# EAGLE design Shield (EAGLE 8.3.1)

## Sheet 1 of 3
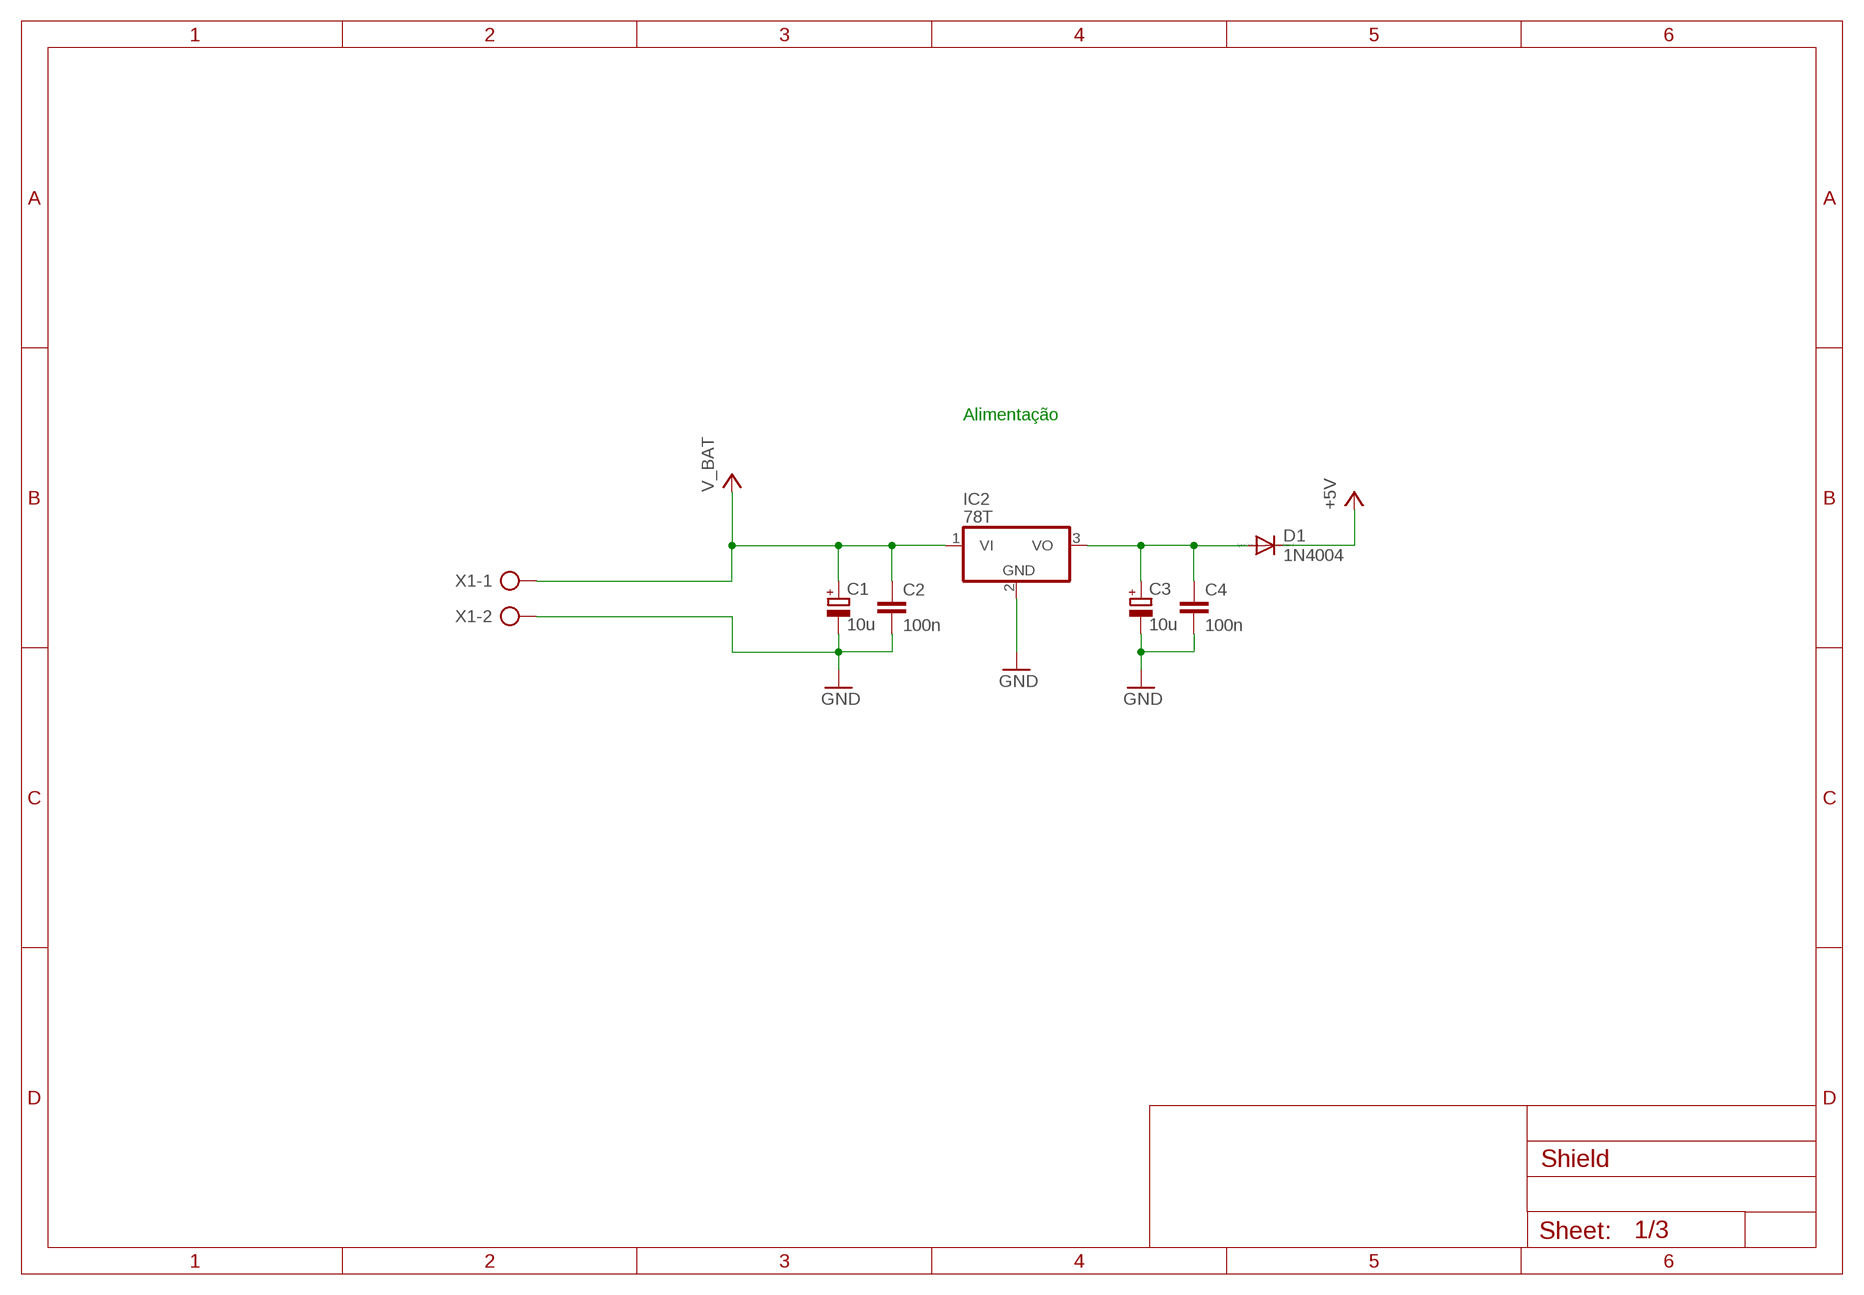
[diagram p0: schematic, sheet 1]

### Parts
C1  10u  CPOL-EUE2.5-5  [E2,5-5]
C2  100n  C-EU025-024X044  [C025-024X044]
C3  10u  CPOL-EUE2.5-5  [E2,5-5]
C4  100n  C-EU025-024X044  [C025-024X044]
D1  1N4004  [DO41-10]
IC2  78T  7805T  [TO220H]
X1  AK300/2  [AK300/2]

### Nets
+5: C3.+ C4.1 D1.A IC2.3(VO)
+5V: D1.C ; also sheet 2,3
GND [Ground]: C1.- C2.2 C3.- C4.2 IC2.2(GND) X1.2 ; also sheet 2,3
V_BAT [Power]: C1.+ C2.1 IC2.1(VI) X1.1 ; also sheet 2,3

### Notes on the sheet
- Alimentação

## Sheet 2 of 3
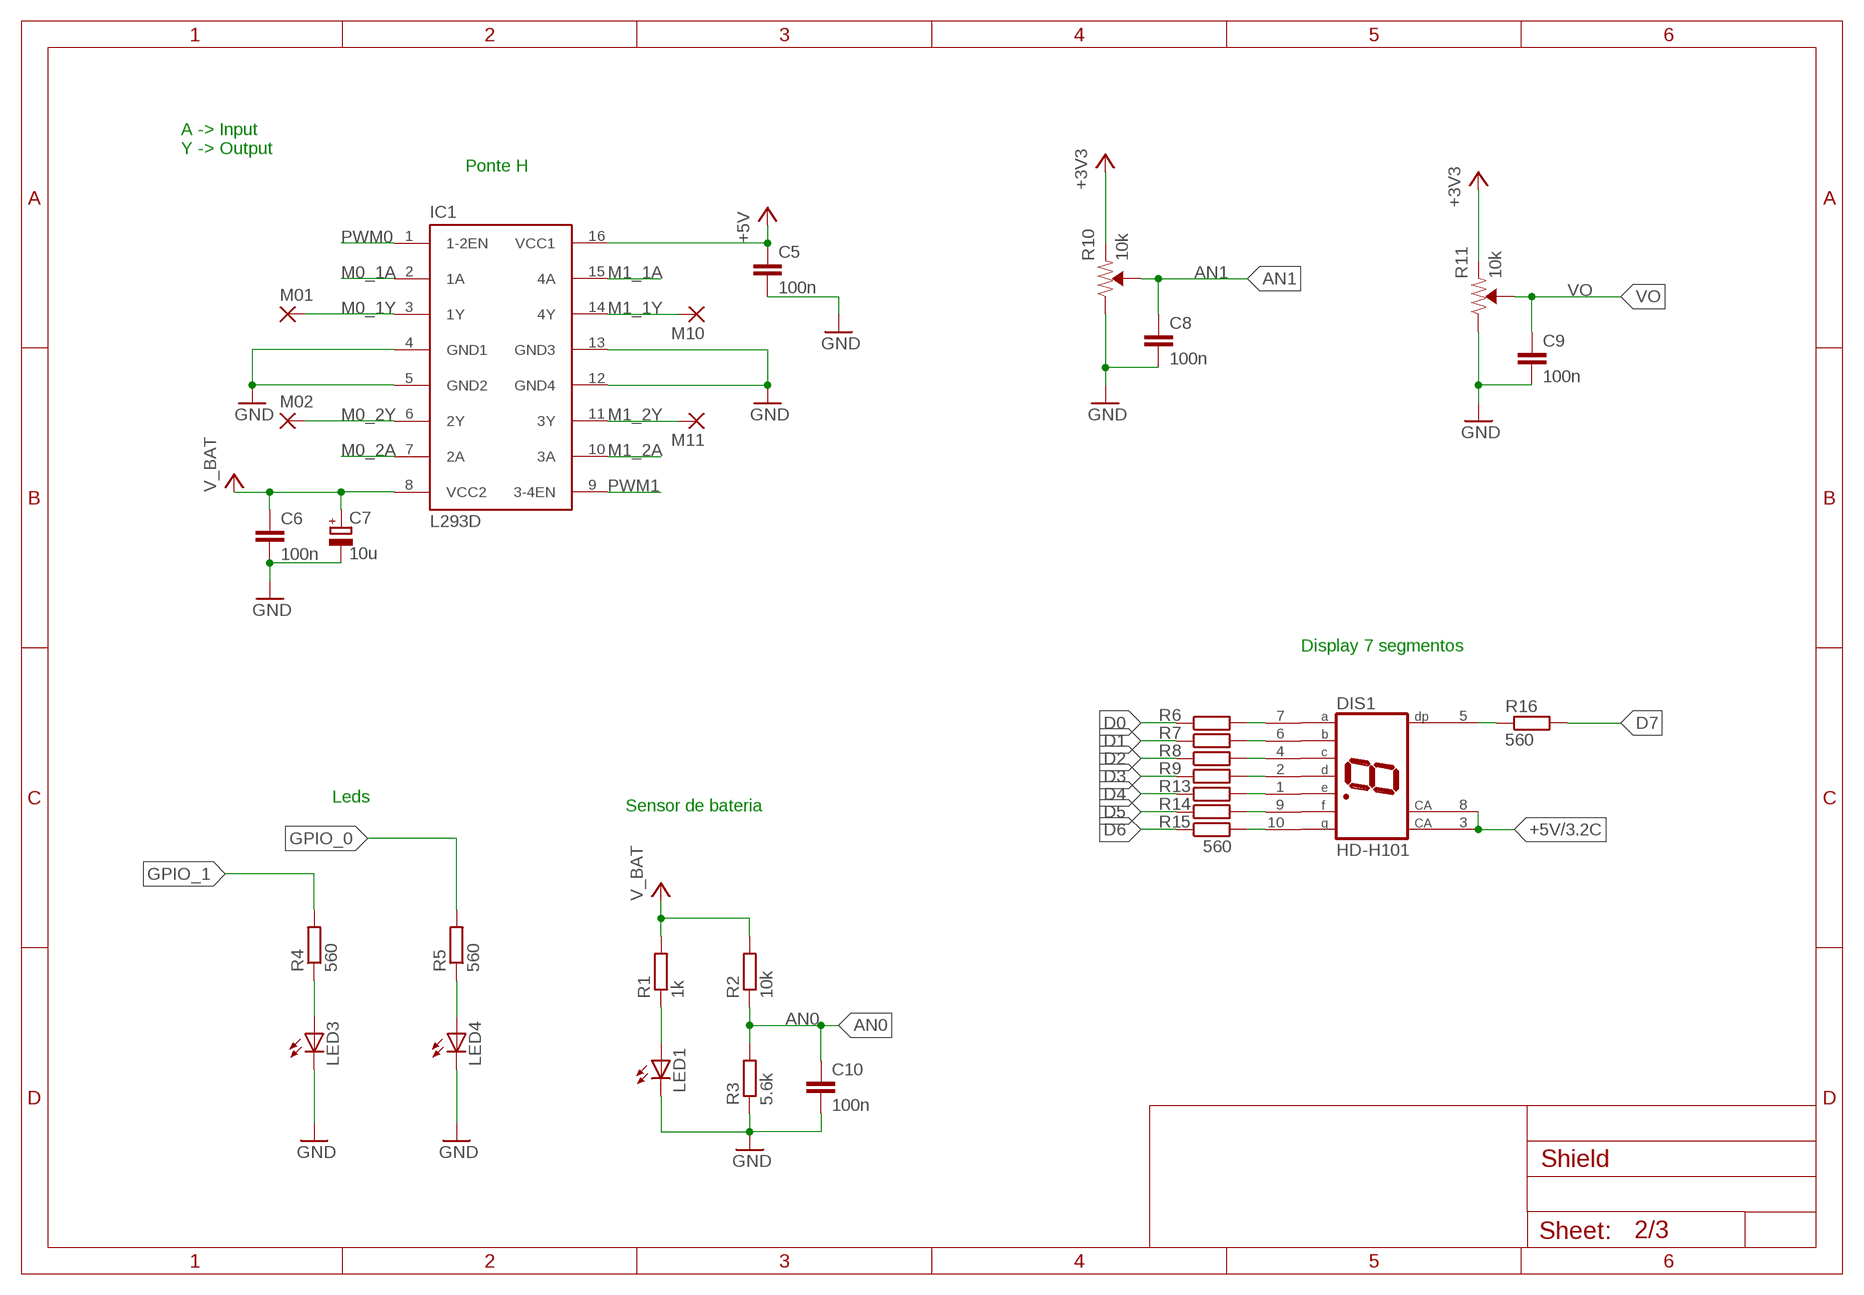
[diagram p1: schematic, sheet 2]

### Parts
C5  100n  C-EU025-024X044  [C025-024X044]
C6  100n  C-EU025-024X044  [C025-024X044]
C7  10u  CPOL-EUE2.5-5  [E2,5-5]
C8  100n  C-EU025-024X044  [C025-024X044]
C9  100n  C-EU025-024X044  [C025-024X044]
C10  100n  C-EU025-024X044  [C025-024X044]
DIS1  HD-H101  [HDSP-M]
IC1  L293D  [DIL16]
LED1  LED5MM  [LED5MM]
LED3  LED5MM  [LED5MM]
LED4  LED5MM  [LED5MM]
M01  2,54/1,1  [2,54/1,1]
M02  2,54/1,1  [2,54/1,1]
M10  2,54/1,1  [2,54/1,1]
M11  2,54/1,1  [2,54/1,1]
R1  1k  R-EU_0204/7  [0204/7]
R2  10k  R-EU_0204/7  [0204/7]
R3  5.6k  R-EU_0204/7  [0204/7]
R4  560  R-EU_0204/7  [0204/7]
R5  560  R-EU_0204/7  [0204/7]
R6  560  R-EU_0204/7  [0204/7]
R7  560  R-EU_0204/7  [0204/7]
R8  560  R-EU_0204/7  [0204/7]
R9  560  R-EU_0204/7  [0204/7]
R10  10k  TRIMPOT-PTH-10MM-KNOB-1/2W-10%  [TRIMPOT-PTH-3386U]
R11  10k  TRIMPOT-PTH-10MM-KNOB-1/2W-10%  [TRIMPOT-PTH-3386U]
R13  560  R-EU_0204/7  [0204/7]
R14  560  R-EU_0204/7  [0204/7]
R15  560  R-EU_0204/7  [0204/7]
R16  560  R-EU_0204/7  [0204/7]

### Nets
+3V3: R10.1(CCW) R11.1(CCW) ; also sheet 3
+5V: C5.1 DIS1.3(CA) DIS1.8(CA) IC1.16(VCC1) ; also sheet 1,3
AN0: C10.1 R2.1 R3.2 ; also sheet 3
AN1: C8.1 R10.2(WIPER) ; also sheet 3
D0: R6.1 ; also sheet 3
D1: R7.1 ; also sheet 3
D2: R8.1 ; also sheet 3
D3: R9.1 ; also sheet 3
D4: R13.1 ; also sheet 3
D5: R14.1 ; also sheet 3
D6: R15.1 ; also sheet 3
D7: R16.2 ; also sheet 3
GND [Ground]: C5.2 C6.2 C7.- C8.2 C9.2 C10.2 IC1.4(GND1) IC1.5(GND2) IC1.12(GND4) IC1.13(GND3) LED1.K(C) LED3.K(C) LED4.K(C) R3.1 R10.3(CW) R11.3(CW) ; also sheet 1,3
GPIO_0: R5.2 ; also sheet 3
GPIO_1: R4.2 ; also sheet 3
M0_1A: IC1.2(1A) ; also sheet 3
M0_1Y [Power]: IC1.3(1Y) M01.1(P)
M0_2A: IC1.7(2A) ; also sheet 3
M0_2Y [Power]: IC1.6(2Y) M02.1(P)
M1_1A: IC1.15(4A) ; also sheet 3
M1_1Y [Power]: IC1.14(4Y) M10.1(P)
M1_2A: IC1.10(3A) ; also sheet 3
M1_2Y [Power]: IC1.11(3Y) M11.1(P)
N$2: DIS1.7(A) R6.2
N$3: LED1.A R1.1
N$4: DIS1.6(B) R7.2
N$5: DIS1.4(C) R8.2
N$6: DIS1.2(D) R9.2
N$7: DIS1.1(E) R13.2
N$8: DIS1.9(F) R14.2
N$9: DIS1.10(G) R15.2
N$10: DIS1.5(DP) R16.1
N$11: LED3.A R4.1
N$12: LED4.A R5.1
PWM0: IC1.1(1-2EN) ; also sheet 3
PWM1: IC1.9(3-4EN) ; also sheet 3
V_BAT [Power]: C6.1 C7.+ IC1.8(VCC2) R1.2 R2.2 ; also sheet 1,3
VO: C9.1 R11.2(WIPER) ; also sheet 3

### Notes on the sheet
- A -> Input
  Y -> Output
- Ponte H
- Display 7 segmentos
- Leds
- Sensor de bateria

## Sheet 3 of 3
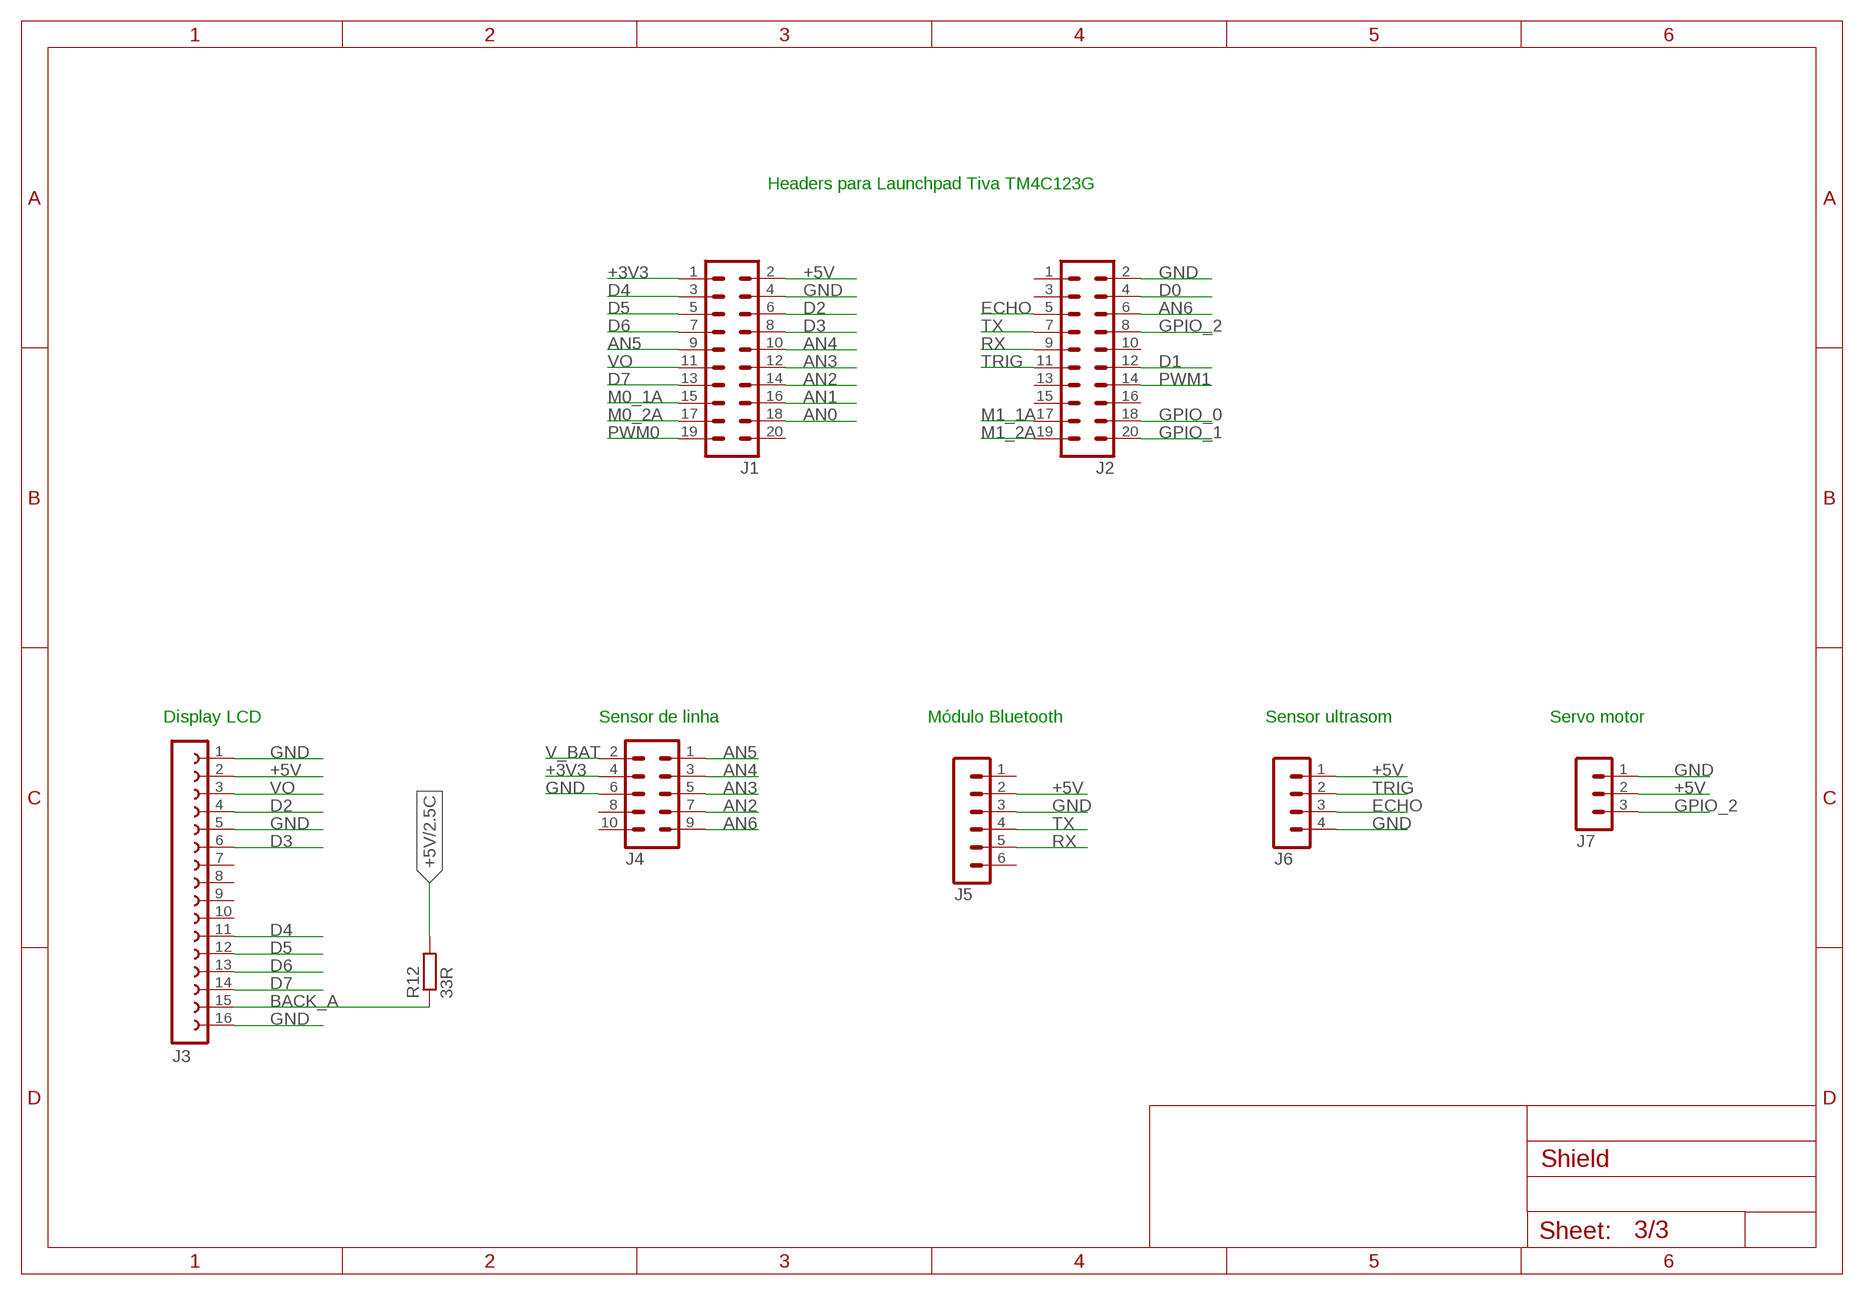
[diagram p2: schematic, sheet 3]

### Parts
J1  MA10-2  [MA10-2]
J2  MA10-2  [MA10-2]
J3  FE16-1  [FE16]
J4  MA05-2  [MA05-2]
J5  MA06-1  [MA06-1]
J6  MA04-1  [MA04-1]
J7  MA03-1  [MA03-1]
R12  33R  R-EU_0204/7  [0204/7]

### Nets
+3V3: J1.1 J4.4 ; also sheet 2
+5V: J1.2 J3.2 J5.2 J6.1 J7.2 R12.2 ; also sheet 1,2
AN0: J1.18 ; also sheet 2
AN1: J1.16 ; also sheet 2
AN2: J1.14 J4.7
AN3: J1.12 J4.5
AN4: J1.10 J4.3
AN5: J1.9 J4.1
AN6: J2.6 J4.9
BACK_A: J3.15 R12.1
D0: J2.4 ; also sheet 2
D1: J2.12 ; also sheet 2
D2: J1.6 J3.4 ; also sheet 2
D3: J1.8 J3.6 ; also sheet 2
D4: J1.3 J3.11 ; also sheet 2
D5: J1.5 J3.12 ; also sheet 2
D6: J1.7 J3.13 ; also sheet 2
D7: J1.13 J3.14 ; also sheet 2
ECHO: J2.5 J6.3
GND [Ground]: J1.4 J2.2 J3.1 J3.5 J3.16 J4.6 J5.3 J6.4 J7.1 ; also sheet 1,2
GPIO_0: J2.18 ; also sheet 2
GPIO_1: J2.20 ; also sheet 2
GPIO_2: J2.8 J7.3
M0_1A: J1.15 ; also sheet 2
M0_2A: J1.17 ; also sheet 2
M1_1A: J2.17 ; also sheet 2
M1_2A: J2.19 ; also sheet 2
PWM0: J1.19 ; also sheet 2
PWM1: J2.14 ; also sheet 2
RX: J2.9 J5.5
TRIG: J2.11 J6.2
TX: J2.7 J5.4
V_BAT [Power]: J4.2 ; also sheet 1,2
VO: J1.11 J3.3 ; also sheet 2
Unconnected: J1.20 J2.1 J2.3 J2.10 J2.13 J2.15 J2.16 J3.7 J3.8 J3.9 J3.10 J4.8 J4.10 J5.1 J5.6

### Notes on the sheet
- Headers para Launchpad Tiva TM4C123G
- Display LCD | Sensor de linha | Módulo Bluetooth | Sensor ultrasom | Servo motor

## Library data of the parts
C1 C3 C7 = rcl:CPOL-EU: POLARIZED CAPACITOR, European symbol
C2 C4-C6 C8-C10 = rcl:C-EU: CAPACITOR, European symbol
D1 = diode:1N4004: DIODE general purpose rectifier, 1 A
DIS1 = display-hp:HD-H101: LED DISPLAY 1-character 7 segment, decimal point right; OC_FARNELL: unknown; OC_NEWARK: unknown
IC1 = st-microelectronics:L293D: PUSH-PULL 4 CHANNEL DRIVER; MPN: L293D; OC_FARNELL: 9589619; OC_NEWARK: 56P8249
IC2 = linear:78*: Positive VOLTAGE REGULATOR Source: http://cache.national.com/ds/LM/LM78L05.pdf http://www.fairchildsemi.com/ds/LM/LM7805.pdf
J1 J2 = con-lstb:MA10-2: PIN HEADER; OC_FARNELL: unknown; OC_NEWARK: unknown
J3 = 0_lucas:FE16-1
J4 = con-lstb:MA05-2: PIN HEADER; OC_FARNELL: unknown; OC_NEWARK: unknown
J5 = con-lstb:MA06-1: PIN HEADER; OC_FARNELL: unknown; OC_NEWARK: unknown
J6 = con-lstb:MA04-1: PIN HEADER; OC_FARNELL: unknown; OC_NEWARK: unknown
J7 = con-lstb:MA03-1: PIN HEADER; OC_FARNELL: unknown; OC_NEWARK: unknown
LED1 LED3 LED4 = led:LED: LED OSRAM: - CHIPLED LG R971, LG N971, LY N971, LG Q971, LY Q971, LO R971, LY R971 LH N974, LH R974 LS Q976, LO Q976, LY Q976 LO Q996 - Hyper CHIPLED LW Q18S LB Q993, LB Q99A, LB R99A - SideLED LS A670, LO A670, LY A670, LG A670, LP A670 LB A673, LV A673, LT A673, LW A673 LH A674 LY A675 LS A676, LA A676, LO A676, LY A676, LW A676 LS A679, LY A679, LG A679 - Hyper Micro SIDELED® LS Y876, LA Y876, LO Y876, LY Y876 LT Y87S - SmartLED LW L88C, LW L88S LB L89C, LB L89S, LG L890 LS L89K, LO L89K, LY L89K LS L896, LA L896, LO L896, LY L896 - TOPLED LS T670, LO T670, LY T670, LG T670, LP T670 LSG T670, LSP T670, LSY T670, LOP T670, LYG T670 LG T671, LOG T671, LSG T671 LB T673, LV T673, LT T673, LW T673 LH T674 LS T676, LA T676, LO T676, LY T676, LB T676, LH T676, LSB T676, LW T676 LB T67C, LV T67C, LT T67C, LS T67K, LO T67K, LY T67K, LW E67C LS E67B, LA E67B, LO E67B, LY E67B, LB E67C, LV E67C, LT E67C LW T67C LS T679, LY T679, LG T679 LS T770, LO T770, LY T770, LG T770, LP T770 LB T773, LV T773, LT T773, LW T773 LH T774 LS E675, LA E675, LY E675, LS T675 LS T776, LA T776, LO T776, LY T776, LB T776 LHGB T686 LT T68C, LB T68C - Hyper Mini TOPLED® LB M676 - Mini TOPLED Santana® LG M470 LS M47K, LO M47K, LY M47K Source: http://www.osram.convergy.de LUXEON: - LUMILED® LXK2-PW12-R00, LXK2-PW12-S00, LXK2-PW14-U00, LXK2-PW14-V00 LXK2-PM12-R00, LXK2-PM12-S00, LXK2-PM14-U00 LXK2-PE12-Q00, LXK2-PE12-R00, LXK2-PE12-S00, LXK2-PE14-T00, LXK2-PE14-U00 LXK2-PB12-K00, LXK2-PB12-L00, LXK2-PB12-M00, LXK2-PB14-N00, LXK2-PB14-P00, LXK2-PB14-Q00 LXK2-PR12-L00, LXK2-PR12-M00, LXK2-PR14-Q00, LXK2-PR14-R00 LXK2-PD12-Q00, LXK2-PD12-R00, LXK2-PD12-S00 LXK2-PH12-R00, LXK2-PH12-S00 LXK2-PL12-P00, LXK2-PL12-Q00, LXK2-PL12-R00 Source: www.luxeon.com KINGBRIGHT: KA-3528ASYC Source: www.kingbright.com
M01 M02 M10 M11 = wirepad:2,54/1,1: THROUGH-HOLE PAD
R1 R3 R6-R9 R12-R16 = rcl:R-EU_: RESISTOR, European symbol
R2 R4 R5 = resistor:R-EU_: RESISTOR, European symbol
R10 R11 = SparkFun-Resistors:TRIMPOT: Trimming Potentiometer (Trimpot) Three-terminal potentiometers, with an adjustable wiper and two adjustable resistors. A pot can be used to create a configurable voltage divider, or as a variable resistor. "Trimpots" are a subset of potentiometers, usually intended for "set-and-forget" applications. They're often more delicate than standard potentiometers - rated for fewer turns. Variants PTH-KNOB - PTH Trimpot w/ finger-adjustable knob Trimpot 10K with Knob <https://www.sparkfun.com/products/9806> (COM-09806) Datasheet <http://www.sparkfun.com/datasheets/Components/General/TSR-3386.pdf> SMD-3MM-CLOSED-FRAME - SMD 3mm Square Closed-Frame Trimpot Used on e.g. EasyDriver - Stepper Motor Driver <https://www.sparkfun.com/products/12779> Datasheet <http://www.bitechnologies.com/pdfs/22.pdf> (22AR10KTR) SMD-5MM - SMD 5mm Square Closed-Frame Trimpot Used on e.g. IOIO-OTG - V2.2 <https://www.sparkfun.com/products/13613> Datasheet <http://www.vishay.com/docs/51008/ts53.pdf> (TS53YL502MR10) SMD-3MM-1/10W-25% - 3mm Square Open-Frame Trimpot Used on e.g. SparkFun Shapeoko <https://www.sparkfun.com/products/13899> Datasheet <http://www.bourns.com/docs/Product-Datasheets/TC33.pdf> (TC33X-2-103E); PROD_ID: RES-09730; SF_SKU: COM-09806
X1 = con-ptr500:AK300/2: CONNECTOR; OC_FARNELL: unknown; OC_NEWARK: unknown

## Net classes
0 Default: width 0.508 mm, drill 0.406 mm, clearance 0.508 mm
1 Ground: width 0.508 mm, drill 0.406 mm, clearance 0.508 mm
2 Power: width 0.762 mm, drill 0.406 mm, clearance 0.508 mm

## Board
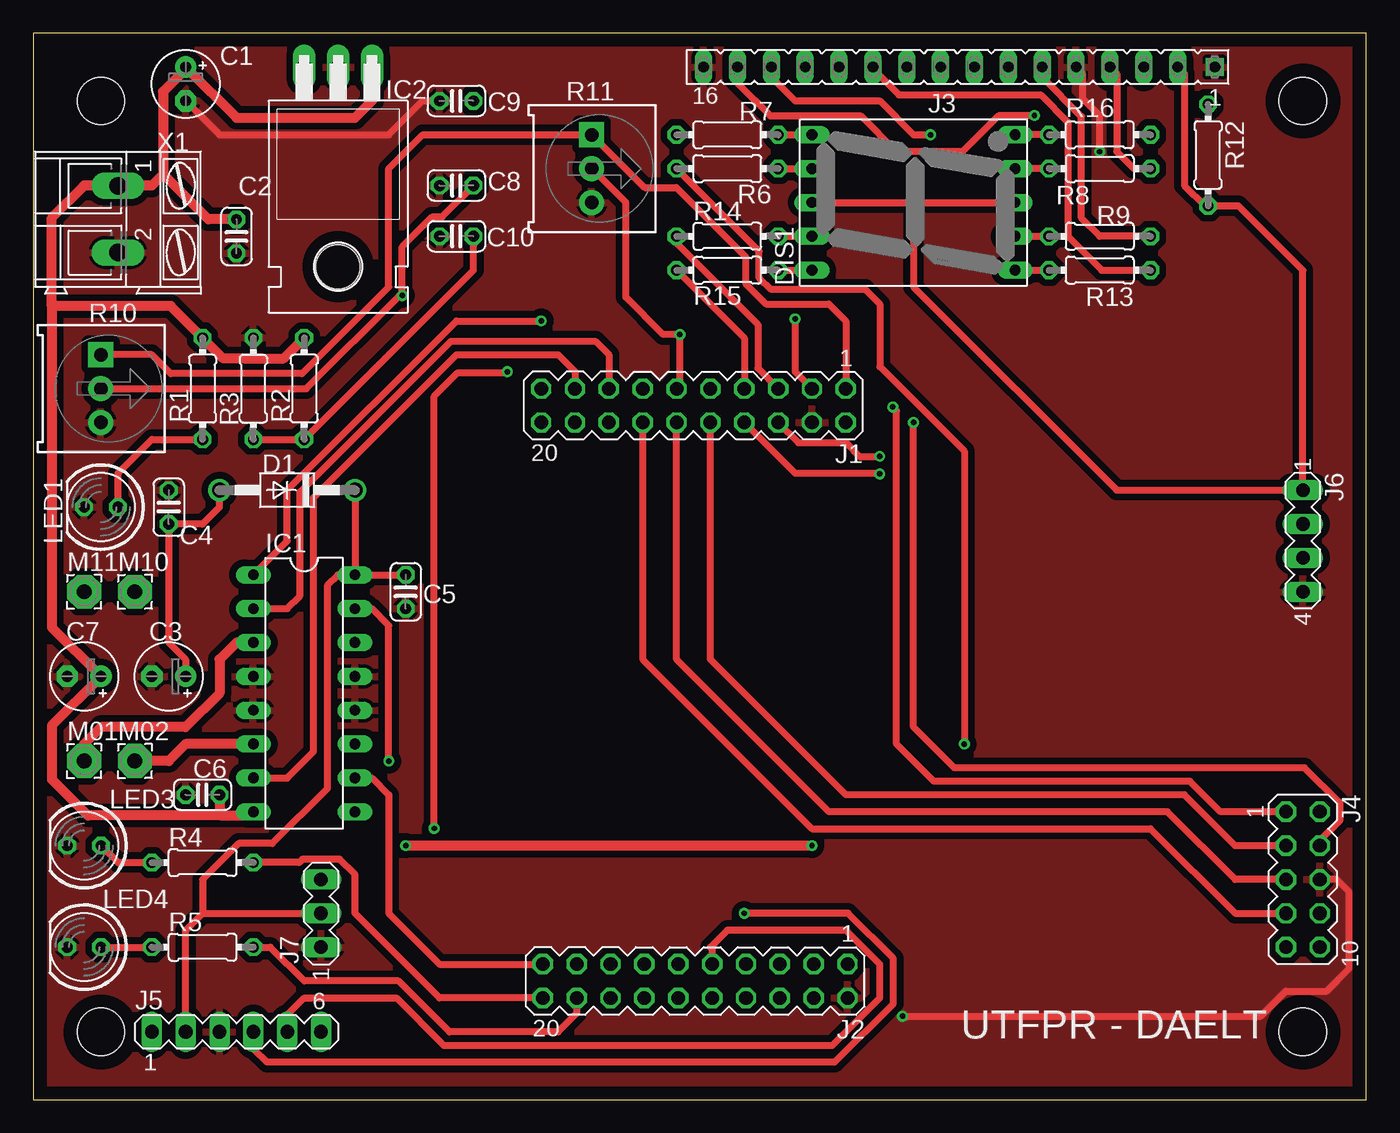
[diagram p3: board, top side]
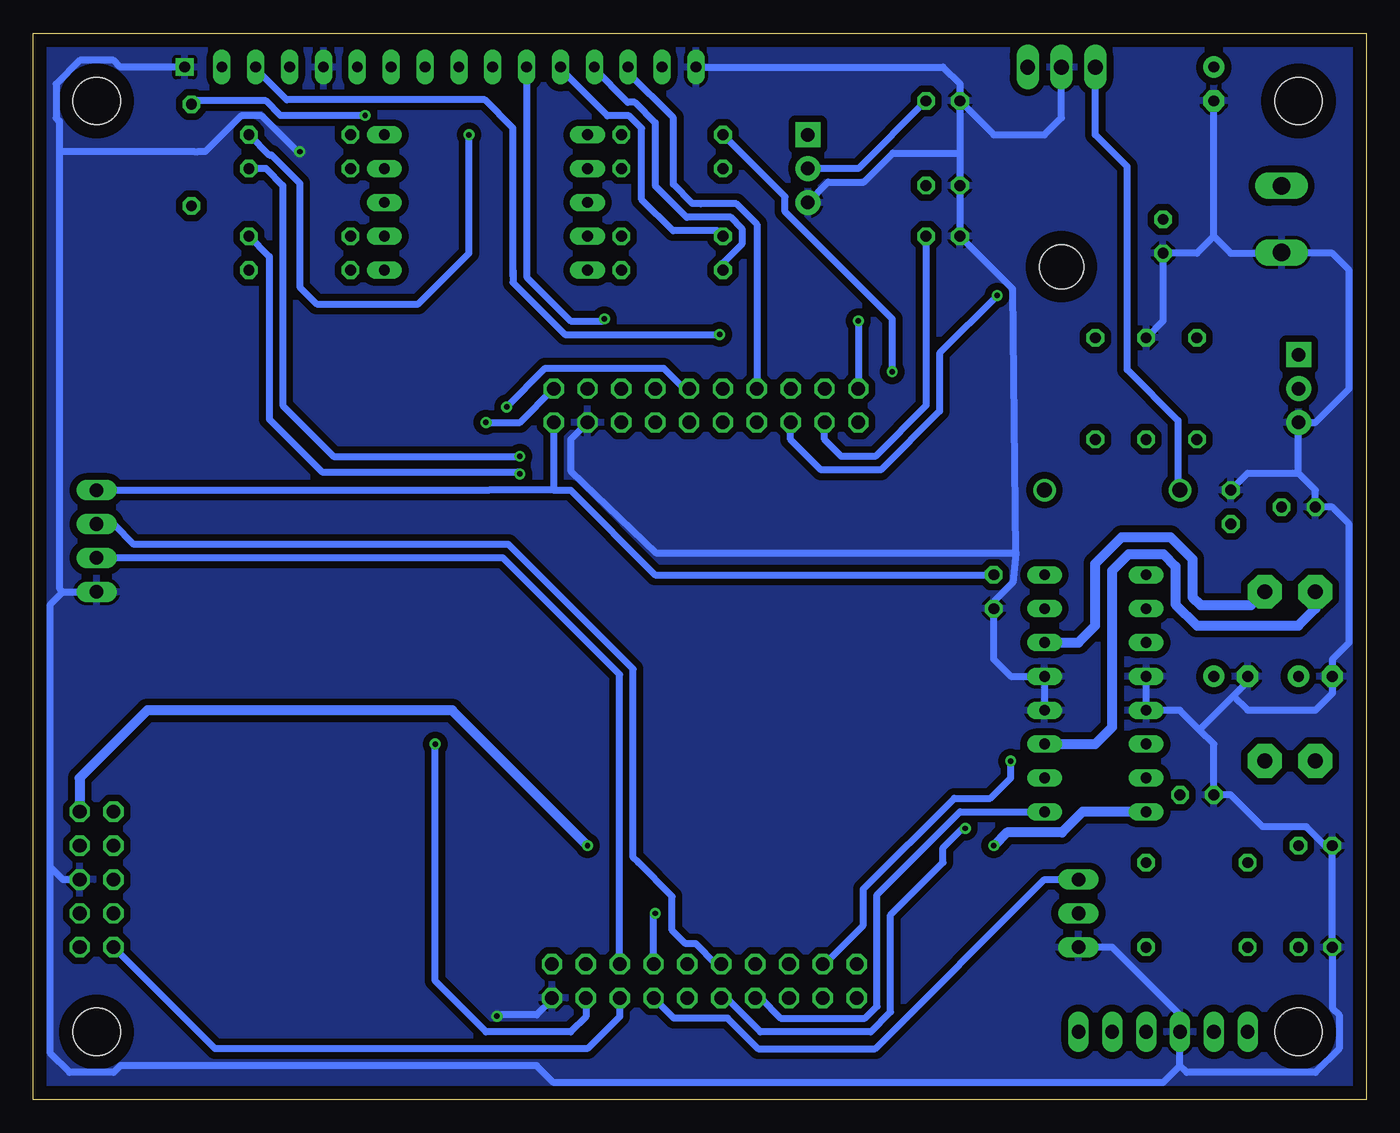
[diagram p4: board, bottom side, seen from below]

Size 100 x 80 mm. Coordinates in mm from the lower left corner, seen from the top.
Outline: 0,0 100,0 100,80 0,80 0,0
Copper layers (1*16): Top 0.035mm / dielectric 1.5mm / Bottom 0.035mm
Design rules "default": minimum track width 6mil, minimum drill 0.35mm, track to track 6mil, track to pad 6mil, pad to pad 6mil, via to via 6mil, smd to smd 6mil, copper to edge 40mil, drill to drill 6mil, minimum pad ring 10mil, minimum via ring 8mil, stop-mask expansion 4mil, vias tented up to drill 0mil, thermal gap 10mil
Holes 3.56 mm at 5.08,74.93 5.08,5.08 95.25,74.93 95.25,5.08

### Footprints (pad centres in the part's own frame; a part is rotated, then mirrored left to right if it is on the bottom)
E2,5-5 = drill 0.813 pad 1.6: + -1.27,0 | drill 0.813 pad 1.6 octagon: - 1.27,0
C025-024X044 = drill 0.813 octagon: 1 -1.27,0; 2 1.27,0
DO41-10 = drill 1.118: A 5.08,0; C -5.08,0
HDSP-M = drill 0.813 long: 1 -5.08,-7.62; 2 -2.54,-7.62; 3 0,-7.62; 4 2.54,-7.62; 5 5.08,-7.62; 6 5.08,7.62; 7 2.54,7.62; 8 0,7.62; 9 -2.54,7.62; 10 -5.08,7.62
DIL16 = drill 0.813 long: 1 -8.89,-3.81; 2 -6.35,-3.81; 3 -3.81,-3.81; 4 -1.27,-3.81; 5 1.27,-3.81; 6 3.81,-3.81; 7 6.35,-3.81; 8 8.89,-3.81; 9 8.89,3.81; 10 6.35,3.81; 11 3.81,3.81; 12 1.27,3.81; 13 -1.27,3.81; 14 -3.81,3.81; 15 -6.35,3.81; 16 -8.89,3.81
TO220H = drill 1.118 long: 1 -2.54,-10.16; 2 0,-10.16; 3 2.54,-10.16 | hole 3.302: 0,4.826
MA10-2 = drill 1.016 octagon: 1 -11.43,-1.27; 2 -11.43,1.27; 3 -8.89,-1.27; 4 -8.89,1.27; 5 -6.35,-1.27; 6 -6.35,1.27; 7 -3.81,-1.27; 8 -3.81,1.27; 9 -1.27,-1.27; 10 -1.27,1.27; 11 1.27,-1.27; 12 1.27,1.27; 13 3.81,-1.27; 14 3.81,1.27; 15 6.35,-1.27; 16 6.35,1.27; 17 8.89,-1.27; 18 8.89,1.27; 19 11.43,-1.27; 20 11.43,1.27
FE16 = drill 0.813 square: 1 -20.574,0 | drill 0.813 long: 2 -17.78,0; 3 -15.24,0; 4 -12.7,0; 5 -10.16,0; 6 -7.62,0; 7 -5.08,0; 8 -2.54,0; 9 0,0; 10 2.54,0; 11 5.08,0; 12 7.62,0; 13 10.16,0; 14 12.7,0; 15 15.24,0; 16 17.78,0
MA05-2 = drill 1.016 octagon: 1 -5.08,-1.27; 2 -5.08,1.27; 3 -2.54,-1.27; 4 -2.54,1.27; 5 0,-1.27; 6 0,1.27; 7 2.54,-1.27; 8 2.54,1.27; 9 5.08,-1.27; 10 5.08,1.27
MA06-1 = drill 1.016 long: 1 -6.35,0; 2 -3.81,0; 3 -1.27,0; 4 1.27,0; 5 3.81,0; 6 6.35,0
MA04-1 = drill 1.016 long: 1 -3.81,0; 2 -1.27,0; 3 1.27,0; 4 3.81,0
MA03-1 = drill 1.016 long: 1 -2.54,0; 2 0,0; 3 2.54,0
LED5MM = drill 0.813 octagon: A -1.27,0; K 1.27,0
2,54/1,1 = drill 1.118 pad 2.54 octagon: 1 0,0
0204/7 = drill 0.813 octagon: 1 -3.81,0; 2 3.81,0
TRIMPOT-PTH-3386U = drill 1.016 pad 1.88 square: 1 -2.54,-0.015 | drill 1.016 pad 1.88: 2 0,-0.015; 3 2.54,-0.015
AK300/2 = drill 1.321 long: 1 -2.515,0; 2 2.489,0

### Placement (x,y rotation side)
C1  11.43,76.2 270 top
C2  15.24,64.77 270 top
C3  10.16,31.75 180 top
C4  10.16,44.45 90 top
C5  27.94,38.1 270 top
C6  12.7,22.86 180 top
C7  3.81,31.75 180 top
C8  31.75,68.58 180 top
C9  31.75,74.93 180 top
C10  31.75,64.77 180 top
D1  19.05,45.72 180 top
DIS1  66.04,67.31 90 top
IC1  20.32,30.48 270 top
IC2  22.86,67.31 180 top
J1  49.53,52.07 180 top
J2  49.66,8.89 180 top
J3  68.07,77.47 180 top
J4  95.25,16.51 270 top
J5  15.24,5.08 0 top
J6  95.25,41.91 270 top
J7  21.59,13.97 90 top
LED1  5.08,44.45 180 top
LED3  3.81,19.05 180 top
LED4  3.81,11.43 180 top
M01  3.81,25.4 0 top
M02  7.62,25.4 0 top
M10  7.62,38.1 0 top
M11  3.81,38.1 0 top
R1  12.7,53.34 90 top
R2  20.32,53.34 90 top
R3  16.51,53.34 270 top
R4  12.7,17.78 0 top
R5  12.7,11.43 0 top
R6  52.07,69.85 0 top
R7  52.07,72.39 0 top
R8  80.01,69.85 180 top
R9  80.01,64.77 180 top
R10  5.08,53.34 270 top
R11  41.91,69.85 270 top
R12  88.14,70.87 270 top
R13  80.01,62.23 180 top
R14  52.07,64.77 0 top
R15  52.07,62.23 0 top
R16  80.01,72.39 0 top
X1  6.35,66.04 270 top

### Tracks (layer width: path | path; a pad name or v marks a point on that pad's centre or on a via)
+3V3  (via drill 0.41)
  Top 0.508: J4.4 96.52,19.43 98.04,20.96 98.04,22.22 95.37,24.89 69.09,24.89 66.04,27.94 v66.04,50.8 | R10.1 8.89,55.88 10.31,54.46 20.17,54.46 26.67,60.96 26.67,69.85 29.21,72.39 R11.1 45.86,68.43 48.25,68.43 53.44,63.23 53.44,61.22 54.97,59.69 59.69,59.69 60.96,58.42 J1.1
  Bottom 0.508: v66.04,50.8 63.5,50.8 J1.1
+5
  Top 0.508: 10.16,42.86 C4.1 | 10.16,42.86 10.16,34.29 11.43,33.02 C3.+ | D1.A 13.97,44.45 12.7,43.18 10.48,43.18 10.16,42.86
  Bottom 0.508: IC2.3 20.32,72.39 17.93,70 17.93,54.76 14.12,50.95 14.12,45.87 D1.A
+5V
  Top 0.508: 12.7,13.97 11.43,12.7 J5.2 | 12.7,13.97 J7.2 | C5.1 IC1.16 23.87,39.37 | 12.7,13.97 12.7,16.51 15.39,19.2 17.93,19.2 22.05,23.32 22.05,38.56 22.86,39.37 23.87,39.37 | D1.C 24.13,39.63 23.87,39.37 | J3.2 86.36,76.96 86.36,68.58 87.88,67.06 R12.2 90.42,67.06 95.25,62.23 J6.1 81.28,45.72 66.04,60.96 66.04,67.31 | DIS1.8 66.04,67.31 | 66.04,67.31 DIS1.3
  Bottom 0.508: J1.2 60.96,46.99 60.96,45.72 | C5.1 53.34,39.37 59.69,45.72 60.96,45.72 | J6.1 65.81,45.72 60.96,45.72
AN0
  Top 0.508: R3.2 R2.1 33.02,62.23 C10.1
  Bottom 0.508: C10.1 33.02,52.07 36.83,48.26 39.37,48.26 40.64,49.53 J1.18
AN1  (via drill 0.41)
  Top 0.508: C8.1 30.63,66.19 29.89,66.19 27.69,63.99 v27.69,60.32 27.47,60.32 20.49,53.34 R10.2
  Bottom 0.508: J1.16 43.18,49.53 40.89,47.24 36.41,47.24 32,51.65 32,56.01 v27.69,60.32
AN2
  Top 0.508: J1.14 45.72,33.02 58.42,20.32 83.82,20.32 90.17,13.97 J4.7
AN3
  Top 0.508: J4.5 90.17,16.51 85.09,21.59 59.69,21.59 48.26,33.02 J1.12
AN4
  Top 0.508: J4.3 90.17,19.05 86.36,22.86 60.96,22.86 50.8,33.02 J1.10
AN5  (via drill 0.41)
  Top 0.508: J4.1 89.07,21.59 86.78,23.88 67.56,23.88 64.77,26.67 64.77,51.69 v64.49,51.97
  Bottom 0.508: J1.9 51.19,53.34 52.71,54.86 61.59,54.86 v64.49,51.97
AN6
  Bottom 0.508: J2.6 56.01,6.22 58.42,3.81 86.36,3.81 J4.9
BACK_A  (via drill 0.41)
  Top 0.508: v75.1,73.83 75.08,73.81 72.41,73.81 69.72,71.12 64.77,71.12 62.08,73.81 55.29,73.81 52.83,76.27 J3.15
  Bottom 0.508: v75.1,73.83 81.45,73.83 82.55,74.93 87.88,74.93 R12.1
D0  (via drill 0.41)
  Top 0.508: v69.85,26.67 69.85,48.64 63.5,54.99 63.5,59.69 62.38,60.81 55.29,60.81 54.46,61.64 54.46,63.65 R6.1
  Bottom 0.508: J2.4 58.55,6.22 59.69,5.08 66.04,5.08 69.85,8.89 v69.85,26.67
D1  (via drill 0.41)
  Top 0.508: v30.07,20.34 30.07,52.77 31.83,54.53 35.48,54.53 v35.56,54.61
  Bottom 0.508: J2.12 48,7.62 45.46,5.08 37.17,5.08 35.69,6.57 35.69,13.84 31.75,17.78 31.75,18.88 30.4,20.24 30.18,20.24 v30.07,20.34 | R7.1 43.6,67.73 43.6,66.61 35.56,58.57 v35.56,54.61
D2  (via drill 0.41)
  Top 0.508: J3.4 81.28,76.96 81.28,71.12 82.55,69.85 R8.1 | J1.6 57.4,49.28 60.96,49.28 61.98,48.26 v63.5,48.26
  Bottom 0.508: R8.1 82.55,69.85 81.28,68.58 81.28,52.07 77.47,48.26 v63.5,48.26
D3  (via drill 0.41)
  Top 0.508: J3.6 75.69,76.71 78.64,73.76 78.64,66.14 80.01,64.77 R9.1 | J1.8 57.15,46.99 63.5,46.99 v63.5,46.94
  Bottom 0.508: 63.55,46.99 v63.5,46.94 63.65,47.09 78.33,47.09 82.3,51.05 82.3,63.25 R9.1
D4  (via drill 0.41)
  Top 0.508: J3.11 62.99,77.34 64.94,75.39 75.58,75.39 77.62,73.34 77.62,64.77 80.16,62.23 R13.1 | J1.3 57.15,54.61 v57.15,58.57
  Bottom 0.508: v57.15,58.57 57.3,58.42 59.69,58.42 62.99,61.72 J3.11
D5
  Top 0.508: R14.1 48.26,64.24 54.36,58.15 54.36,54.86 J1.5
  Bottom 0.508: R14.1 48.67,65.18 52,65.18 54.36,67.54 54.36,72.88 55.29,73.81 56.93,73.81 60.45,77.34 J3.12
D6
  Top 0.508: R15.1 53.34,57.15 J1.7
  Bottom 0.508: R15.1 48.26,62.76 46.84,64.18 46.84,65.36 47.67,66.19 50.95,66.19 arc90 50.98,66.22 53.34,68.58 53.34,73.3 54.87,74.83 55.4,74.83 57.91,77.34 J3.13
D7  (via drill 0.41)
  Top 0.508: J3.14 55.37,76.71 57.15,74.93 63.5,74.93 66.04,72.39 v67.31,72.39
  Bottom 0.508: J1.13 45.72,65.68 47.25,67.21 49.91,67.21 49.94,67.24 50.56,67.24 51.99,68.66 51.99,73.66 55.37,77.05 J3.14 | R16.2 82.3,70.87 82.13,70.87 80.01,68.75 80.01,60.96 78.74,59.69 71.12,59.69 67.31,63.5 v67.31,72.39
ECHO
  Bottom 0.508: J2.5 56.01,31.88 64.77,40.64 J6.3
GND  (via drill 0.41)
  Top 0.508: v65.22,6.25 92.11,6.25 93.99,8.13 97.03,8.13 98.73,9.83 98.73,15.57 97.79,16.51 J4.6 | C1.- 13.97,72.39 26.67,72.39 29.21,74.93 C9.2 | J3.5 78.74,76.96 78.74,75.1 80.01,73.83 v80.01,71.12
  Bottom 0.508: 97.79,38.1 J6.4 | 97.79,38.1 98.73,37.16 98.73,17.45 | 98.73,17.45 97.79,16.51 J4.6 | J3.1 93.48,77.47 93.99,77.98 96.51,77.98 98.3,76.19 98.3,73.67 98.04,73.41 98.04,71.12 | 98.04,71.12 98.04,38.35 97.79,38.1 | 98.73,17.45 98.73,3.48 97.28,2.03 93.99,2.03 93.48,2.54 62.23,2.54 60.96,1.27 15.24,1.27 13.97,2.54 | 13.97,2.54 J5.3 13.97,6.35 19.05,11.43 J7.1 | 13.97,2.54 13.46,2.03 3.82,2.03 2.03,3.82 2.03,6.34 2.54,6.85 LED4.K LED3.K 3.07,19.05 4.49,20.47 7.77,20.47 10.16,22.86 C6.2 11.43,26.67 12.51,27.75 | J2.2 61.09,7.49 62.23,6.35 65.12,6.35 v65.22,6.25 | 12.51,27.75 13.97,29.21 IC1.5 IC1.4 | IC1.12 IC1.13 26.67,31.75 27.94,33.02 C5.2 27.94,37.36 26.52,38.78 26.26,41.01 | C3.- 8.89,31.36 9.96,30.29 | 9.96,30.29 12.51,27.75 | 9.96,30.29 8.89,29.21 3.81,29.21 2.54,30.48 C7.- 2.54,33.02 1.27,34.29 1.27,43.18 2.54,44.45 LED1.K 3.81,45.72 5.08,46.99 | 26.26,41.01 26.52,60.81 C10.2 C8.2 30.48,71.01 | 5.08,46.99 5.08,50.78 R10.3 3.81,50.8 1.27,53.34 1.27,62.23 2.54,63.5 6.3,63.5 X1.2 6.4,63.5 10.16,63.5 11.43,64.77 | C4.2 8.89,46.99 5.08,46.99 | 11.43,64.77 C1.- | 11.43,64.77 12.7,63.5 C2.2 15.24,58.42 R3.1 | C9.2 30.48,71.01 | C9.2 27.94,72.39 24.13,72.39 22.86,73.66 IC2.2 | R11.3 40.37,68.83 37.68,68.83 35.51,71.01 30.48,71.01 | J1.4 59.69,49.53 59.69,47.16 53.29,41.01 26.26,41.01 | J3.16 31.75,77.47 30.48,76.2 C9.2 | 98.04,71.12 87.94,71.12 87.63,71.12 87.1,71.12 84.41,73.81 82.87,73.81 80.18,71.12 v80.01,71.12
  pour Bottom: 0,79.88 0,0.13 99.95,0.13 99.95,79.88
  pour Top: 0.25,79.88 0.25,0.13 100.08,0.13 100.08,79.76
GPIO_0
  Top 0.508: R5.2 17.78,11.43 20.32,8.89 27.41,8.89 31.21,5.08 39.37,5.08 40.77,6.48 J2.18
GPIO_1
  Top 0.508: J2.20 30.48,7.62 24.13,13.97 24.13,16.51 | 24.13,16.51 24.13,16.89 | R4.2 19.94,17.78 20.2,18.03 22.98,18.03 24.13,16.89 | 24.13,16.51 24.13,16.89
GPIO_2
  Bottom 0.508: J7.3 24.13,16.51 36.83,3.81 45.63,3.81 47.91,6.1 51.94,6.1 J2.8
M0_1A
  Top 0.508: IC1.2 19.05,36.83 20.02,37.8 20.02,45.58 31.33,56.9 39.37,56.9 | 39.37,56.9 39.79,56.9 | 39.37,56.9 42.16,56.9 43.18,55.88 J1.15
M0_1Y
  Top 0.762: IC1.3 15.24,34.29 13.97,33.02 13.97,30.48 11.43,27.94 5.08,27.94 3.81,26.67 M01.1
M0_2A
  Top 0.508: IC1.7 19.05,24.13 21.03,26.11 21.03,45.16 31.75,55.88 39.37,55.88 40.64,54.61 J1.17
M0_2Y
  Top 0.762: IC1.6 11.43,26.67 10.16,25.4 M02.1
M1_1A  (via drill 0.41)
  Top 0.508: v26.67,25.4 26.67,35.56 25.4,36.83 IC1.15
  Bottom 0.508: J2.17 40.64,10.16 37.72,13.08 37.72,15.79 30.9,22.61 28.19,22.61 26.67,24.13 v26.67,25.4
M1_1Y
  Bottom 0.762: IC1.14 21.59,34.29 20.32,35.56 20.32,40.21 18.34,42.19 14.68,42.19 13.03,40.54 13.03,37.69 12.44,37.09 8.63,37.09 M10.1
M1_2A
  Top 0.508: IC1.10 25.4,24.13 26.67,22.86 26.67,13.97 30.48,10.16 J2.19
M1_2Y
  Bottom 0.762: IC1.11 20.32,26.67 19.05,27.94 19.05,39.68 17.81,40.92 15.21,40.92 14.3,40.01 14.3,37.16 12.7,35.56 5.08,35.56 3.81,36.83 M11.1
N$2
  Top 0.508: R6.2 DIS1.7
N$3
  Top 0.508: LED1.A 6.35,46.99 8.89,49.53 R1.1
N$4
  Top 0.508: R7.2 DIS1.6
N$5
  Top 0.508: R8.2 DIS1.4
N$6
  Top 0.508: DIS1.2 R9.2
N$7
  Top 0.508: DIS1.1 R13.2
N$8
  Top 0.508: R14.2 DIS1.9
N$9
  Top 0.508: R15.2 DIS1.10
N$10
  Top 0.508: R16.1 DIS1.5
N$11
  Top 0.508: LED3.A 6.35,17.78 R4.1
N$12
  Top 0.508: LED4.A R5.1
PWM0  (via drill 0.41)
  Top 0.508: IC1.1 19.05,41.91 19.05,45.72 31.75,58.42 v38.1,58.42
  Bottom 0.508: v38.1,58.42 J1.19
PWM1
  Bottom 0.508: J2.14 45.46,7.62 43.94,6.1 37.6,6.1 36.7,6.99 36.7,15.37 30.48,21.59 IC1.9
RX
  Top 0.508: J2.9 50.93,11.3 50.8,11.43 52.07,12.7 60.96,12.7 63.5,10.16 63.5,7.62 59.94,4.06 30.79,4.06 27.24,7.62 20.32,7.62 19.05,6.35 J5.5
TRIG
  Bottom 0.508: J2.11 48.77,10.16 50.3,11.68 51.05,11.68 52.07,12.7 52.07,15.24 54.61,17.78 54.99,18.16 54.99,32.3 64.35,41.66 92.46,41.66 93.98,43.18 J6.2
TX  (via drill 0.41)
  Top 0.508: v53.34,13.97 61.13,13.97 64.52,10.58 64.52,7.2 60.11,2.79 17.53,2.79 16.51,3.81 J5.4
  Bottom 0.508: v53.34,13.97 53.47,13.84 J2.7
V_BAT  (via drill 0.41)
  Top 0.762: IC1.8 16.23,21.31 14.12,21.31 | 14.12,21.31 4.09,21.31 1.4,24 1.4,28.07 C7.+ 1.4,35.43 1.4,59.54 | C6.1 13.97,21.46 14.12,21.31 | v58.42,19.05 v27.94,19.05 | 1.4,59.54 1.4,66.17 3.81,68.58 6.33,68.58 | 6.33,68.58 X1.1 | 9.74,69.43 8.89,68.58 6.33,68.58 | 9.74,69.43 9.74,75.63 11.43,77.32 C1.+ 15.24,73.66 24.13,73.66 25.4,74.93 IC2.1 | C2.1 13.13,66.04 9.74,69.43 | 1.4,59.54 10.31,59.54 R1.2 14.25,55.6 15.87,55.6 | 17.15,55.6 15.87,55.6 | 15.87,55.6 18.77,55.6 R2.2
  Bottom 0.762: J4.2 96.52,24.13 91.44,29.21 68.58,29.21 v58.42,19.05 | IC1.8 21.28,21.59 22.83,20.04 26.95,20.04 v27.94,19.05
VO  (via drill 0.41)
  Top 0.508: R11.2 41.91,69.85 44.45,67.31 44.45,60.2 47.24,57.4 v48.51,57.4 48.51,53.59 J1.11
  Bottom 0.508: C9.1 38.1,69.85 R11.2 | 64.01,61.81 64.01,62.23 | 64.01,62.23 64.01,72.9 66.11,75 80.98,75 83.31,77.34 J3.3 | 64.01,62.23 64.01,61.3 60.11,57.4 v48.51,57.4

### Text on the board
tNames: UTFPR - DAELT